# Altium schematic sheet LED_ARRAY.SchDoc
size C; SheetNumber: 6; SheetTotal: 6
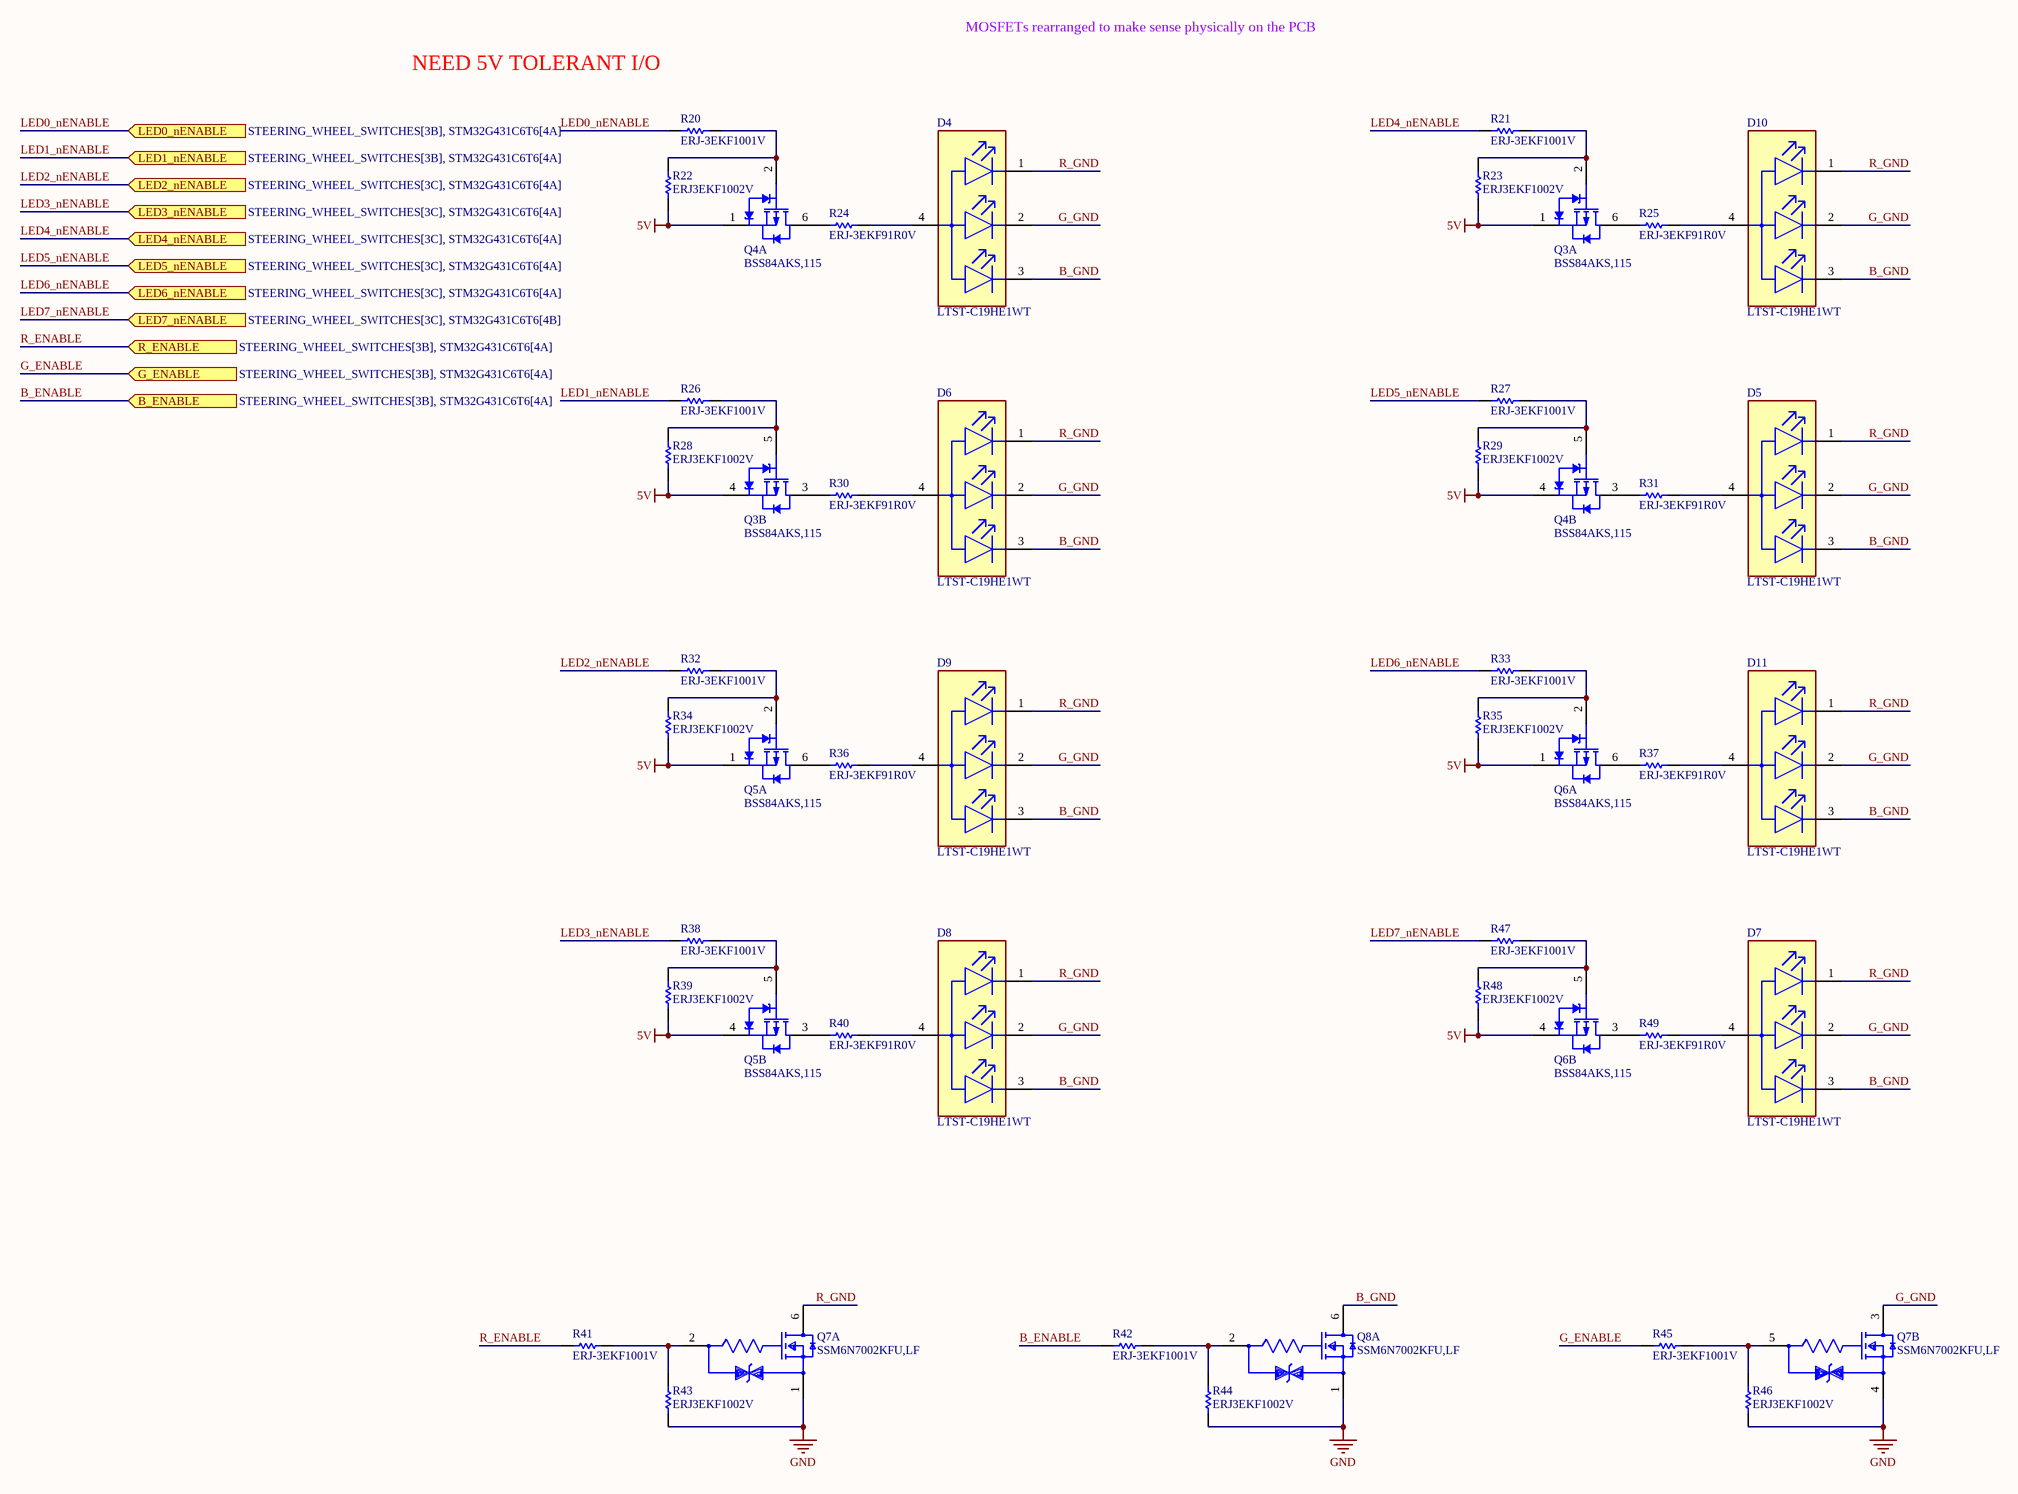
[diagram p0: LED_ARRAY.SchDoc]

## Parts
D4  LTST-C19HE1WT  [FP-LTST-C19HE1WT-MFG]
D5  LTST-C19HE1WT  [FP-LTST-C19HE1WT-MFG]
D6  LTST-C19HE1WT  [FP-LTST-C19HE1WT-MFG]
D7  LTST-C19HE1WT  [FP-LTST-C19HE1WT-MFG]
D8  LTST-C19HE1WT  [FP-LTST-C19HE1WT-MFG]
D9  LTST-C19HE1WT  [FP-LTST-C19HE1WT-MFG]
D10  LTST-C19HE1WT  [FP-LTST-C19HE1WT-MFG]
D11  LTST-C19HE1WT  [FP-LTST-C19HE1WT-MFG]
Q3  BSS84AKS,115  [NXP-SOT363_L]  (parts A,B of 2)
Q4  BSS84AKS,115  [NXP-SOT363_L]  (parts A,B of 2)
Q5  BSS84AKS,115  [NXP-SOT363_L]  (parts A,B of 2)
Q6  BSS84AKS,115  [NXP-SOT363_L]  (parts A,B of 2)
Q7  SSM6N7002KFU,LF  [FP-SSOP6-P-0_65A-MFG]  (parts A,B of 2)
Q8  SSM6N7002KFU,LF  [FP-SSOP6-P-0_65A-MFG]  (part A of 2)
R20  ERJ-3EKF1001V  [RESC1608X55X30LL15T15]
R21  ERJ-3EKF1001V  [RESC1608X55X30LL15T15]
R22  ERJ3EKF1002V  [RESC1609X55X30LL15T15]
R23  ERJ3EKF1002V  [RESC1609X55X30LL15T15]
R24  ERJ-3EKF91R0V  [RESC1608X55X30NL15T15]
R25  ERJ-3EKF91R0V  [RESC1608X55X30NL15T15]
R26  ERJ-3EKF1001V  [RESC1608X55X30LL15T15]
R27  ERJ-3EKF1001V  [RESC1608X55X30LL15T15]
R28  ERJ3EKF1002V  [RESC1609X55X30LL15T15]
R29  ERJ3EKF1002V  [RESC1609X55X30LL15T15]
R30  ERJ-3EKF91R0V  [RESC1608X55X30NL15T15]
R31  ERJ-3EKF91R0V  [RESC1608X55X30NL15T15]
R32  ERJ-3EKF1001V  [RESC1608X55X30LL15T15]
R33  ERJ-3EKF1001V  [RESC1608X55X30LL15T15]
R34  ERJ3EKF1002V  [RESC1609X55X30LL15T15]
R35  ERJ3EKF1002V  [RESC1609X55X30LL15T15]
R36  ERJ-3EKF91R0V  [RESC1608X55X30NL15T15]
R37  ERJ-3EKF91R0V  [RESC1608X55X30NL15T15]
R38  ERJ-3EKF1001V  [RESC1608X55X30LL15T15]
R39  ERJ3EKF1002V  [RESC1609X55X30LL15T15]
R40  ERJ-3EKF91R0V  [RESC1608X55X30NL15T15]
R41  ERJ-3EKF1001V  [RESC1608X55X30LL15T15]
R42  ERJ-3EKF1001V  [RESC1608X55X30LL15T15]
R43  ERJ3EKF1002V  [RESC1609X55X30LL15T15]
R44  ERJ3EKF1002V  [RESC1609X55X30LL15T15]
R45  ERJ-3EKF1001V  [RESC1608X55X30LL15T15]
R46  ERJ3EKF1002V  [RESC1609X55X30LL15T15]
R47  ERJ-3EKF1001V  [RESC1608X55X30LL15T15]
R48  ERJ3EKF1002V  [RESC1609X55X30LL15T15]
R49  ERJ-3EKF91R0V  [RESC1608X55X30NL15T15]

## Ports
B_ENABLE (in, see STEERING_WHEEL_SWITCHES[3B], STM32G431C6T6[4A]), G_ENABLE (in, see STEERING_WHEEL_SWITCHES[3B], STM32G431C6T6[4A]), LED0_nENABLE (in, see STEERING_WHEEL_SWITCHES[3B], STM32G431C6T6[4A]), LED1_nENABLE (in, see STEERING_WHEEL_SWITCHES[3B], STM32G431C6T6[4A]), LED2_nENABLE (in, see STEERING_WHEEL_SWITCHES[3C], STM32G431C6T6[4A]), LED3_nENABLE (in, see STEERING_WHEEL_SWITCHES[3C], STM32G431C6T6[4A]), LED4_nENABLE (in, see STEERING_WHEEL_SWITCHES[3C], STM32G431C6T6[4A]), LED5_nENABLE (in, see STEERING_WHEEL_SWITCHES[3C], STM32G431C6T6[4A]), LED6_nENABLE (in, see STEERING_WHEEL_SWITCHES[3C], STM32G431C6T6[4A]), LED7_nENABLE (in, see STEERING_WHEEL_SWITCHES[3C], STM32G431C6T6[4B]), R_ENABLE (in, see STEERING_WHEEL_SWITCHES[3B], STM32G431C6T6[4A])

## Nets
5V: Q3.1(S1) Q3.4(S2) Q4.1(S1) Q4.4(S2) Q5.1(S1) Q5.4(S2) Q6.1(S1) Q6.4(S2) R22.1 R23.1 R28.1 R29.1 R34.1 R35.1 R39.1 R48.1
GND: Q7.1(Source1) Q7.4(Source2) Q8.1(Source1) R43.1 R44.1 R46.1
B_ENABLE: R42.1 ; port B_ENABLE
B_GND: D4.3(BLUE_C) D5.3(BLUE_C) D6.3(BLUE_C) D7.3(BLUE_C) D8.3(BLUE_C) D9.3(BLUE_C) D10.3(BLUE_C) D11.3(BLUE_C) Q8.6(Drain1)
G_ENABLE: R45.1 ; port G_ENABLE
G_GND: D4.2(GREEN_C) D5.2(GREEN_C) D6.2(GREEN_C) D7.2(GREEN_C) D8.2(GREEN_C) D9.2(GREEN_C) D10.2(GREEN_C) D11.2(GREEN_C) Q7.3(Drain2)
LED0_nENABLE: R20.1 ; port LED0_nENABLE
LED1_nENABLE: R26.1 ; port LED1_nENABLE
LED2_nENABLE: R32.1 ; port LED2_nENABLE
LED3_nENABLE: R38.1 ; port LED3_nENABLE
LED4_nENABLE: R21.1 ; port LED4_nENABLE
LED5_nENABLE: R27.1 ; port LED5_nENABLE
LED6_nENABLE: R33.1 ; port LED6_nENABLE
LED7_nENABLE: R47.1 ; port LED7_nENABLE
R_ENABLE: R41.1 ; port R_ENABLE
R_GND: D4.1(RED_C) D5.1(RED_C) D6.1(RED_C) D7.1(RED_C) D8.1(RED_C) D9.1(RED_C) D10.1(RED_C) D11.1(RED_C) Q7.6(Drain1)
NetD4_4: D4.4(A) R24.2
NetD5_4: D5.4(A) R31.2
NetD6_4: D6.4(A) R30.2
NetD7_4: D7.4(A) R49.2
NetD8_4: D8.4(A) R40.2
NetD9_4: D9.4(A) R36.2
NetD10_4: D10.4(A) R25.2
NetD11_4: D11.4(A) R37.2
NetQ3_2: Q3.2(G1) R21.2 R23.2
NetQ3_3: Q3.3(D2) R30.1
NetQ3_5: Q3.5(G2) R26.2 R28.2
NetQ3_6: Q3.6(D1) R25.1
NetQ4_2: Q4.2(G1) R20.2 R22.2
NetQ4_3: Q4.3(D2) R31.1
NetQ4_5: Q4.5(G2) R27.2 R29.2
NetQ4_6: Q4.6(D1) R24.1
NetQ5_2: Q5.2(G1) R32.2 R34.2
NetQ5_3: Q5.3(D2) R40.1
NetQ5_5: Q5.5(G2) R38.2 R39.2
NetQ5_6: Q5.6(D1) R36.1
NetQ6_2: Q6.2(G1) R33.2 R35.2
NetQ6_3: Q6.3(D2) R49.1
NetQ6_5: Q6.5(G2) R47.2 R48.2
NetQ6_6: Q6.6(D1) R37.1
NetQ7_2: Q7.2(Gate1) R41.2 R43.2
NetQ7_5: Q7.5(Gate2) R45.2 R46.2
NetQ8_2: Q8.2(Gate1) R42.2 R44.2

## Notes on the sheet
- NEED 5V TOLERANT I/O
- MOSFETs rearranged to make sense physically on the PCB

## Library data of the parts
D4-D11 = CMP-2000-05201-2: LED RGB DIFFUSED CHIP SMD; Number of LEDs: 3; Test Current: 20mA; Luminous Intensity: 180mcd; Lens Color: White; Dominant Wavelength: 470nm; Color: Blue; Reverse Voltage: 5V; Viewing Angle: 130°; Forward Voltage: 3.35V; Max Operating Temperature: 80°C; Packaging: Tape and Reel; Lens Transparency: Diffused; Width: 1.6mm; Case Code (Metric): 1616; Height: 0.35mm; Lens Style: Diffused; Mount: Surface Mount; Package Quantity: 3000; Radiation Hardening: No; Length: 1.6mm; Case/Package: 0606; Forward Current: 20mA; Case Code (Imperial): 0606; Lead Free: Lead Free; Min Operating Temperature: -20°C; Number of Elements: 3; Number of Pins: 4; Depth: 1.6mm
Q3-Q6 = CMP-1259-00116-1: Dual P-Channel Trench MOSFET, -50 V, -0.16 A, -55 to 150 degC, 6-Pin SOT363, Tape and Reel; Manufacturer: NXP Semiconductors; VGSth [typ] (V): -1.6; Automotive Qualified: Y; Channel Type: P; IDM [max] (A): -0.64; Packing: Tape & Reel; Mounting Technology: Surface Mount; PackageDescription: 6-Pin Small Outline Transistor Package, Body 2 x 1.25 mm, Pitch 0.65 mm; ComponentLink2URL: http://www.nxp.com/documents/data_sheet/BSS84AKS.pdf; ComponentLink3URL: http://www.nxp.com/documents/outline_drawing/sot363_po.pdf; PartNumber: BSS84AKS,115; PackageReference: SOT363; PackageVersion: 06-03-16, 03/2006; ComponentLink3Description: Package Specification; ComponentLink2Description: Datasheet; ComponentLink1Description: Manufacturer URL; VDS [max] (V): -50; Code_JEITA: SC-88; ID [max] (A): -0.16; DatasheetVersion: Rev. 1; ComponentLink1URL: http://www.nxp.com/
Q7 Q8 = CMP-35916-000009-1: MOSFET 2N-CH 60V 0.3A; Input Capacitance: 40pF; Continuous Drain Current (ID): 300mA; Max Power Dissipation: 285mW; FET Type: 2 N-Channel; Rds On Max: 1.5R; Mount: Surface Mount; Drain to Source Voltage (Vdss): 60V; Packaging: Tape and Reel
R20 R21 R26 R27 R32 R33 R38 R41 R42 R45 R47 = CMP-2000-00180-1: Manufacturer: Panasonic; Part Number: ERJ-3EKF1001V
R22 R23 R28 R29 R34 R35 R39 R43 R44 R46 R48 = CMP-1012-00623-3: Chip Resistor, 10 KOhm, +/- 1%, 0.1 W, -55 to 155 degC, 0603 (1608 Metric), RoHS, Tape and Reel; Manufacturer: Panasonic; Voltage Rating: 75V; Case\/Package: 0603; Power Rating: 100mW; Resistance: 10KOhm; Temperature Coefficient: 100ppm\/degreesC; Number of Pins: 2; Package Reference: 603; Depth: 0.8mm; Mount: SurfaceMount; Package Description: 2-Pin Surface Mount Device, Body 1.6 x 0.85 mm; Datasheet Version: 02/2017; Length: 1.6mm; Lead Free: LeadFree; Height: 0.45mm; Number of Terminations: 2; Max Power Dissipation: 100mW; Min Operating Temperature: -55degC; Datasheet URL: https://industrial.panasonic.com/cdbs/www-data/pdf/RDA0000/AOA0000C304.pdf; Termination: SMD/SMT; Case Code (Metric): 1608; Case Code (Imperial): 0603; Tolerance: 1%; Max Operating Temperature: 155degC; RoHSCompliant: true; Voltage Rating (DC): 75V; Radiation Hardening: No; Packaging: TapeandReel; Composition: ThickFilm; Mounting Technology: SurfaceMount; Manufacturer URL: http://www.panasonic.com/; Width: 0.031inch; REACH SVHC: NoSVHC; Contact Plating: Tin; Military Standard: Not; Package Quantity: 1
R24 R25 R30 R31 R36 R37 R40 R49 = CMP-2000-00687-1: Manufacturer: Panasonic; Part Number: ERJ-3EKF91R0V